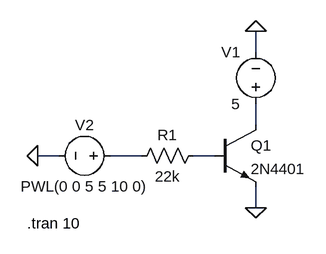
[diagram p0: schematic Übertragungskennlinie.asc]
Übertragungskennlinie.asc, the LTspice schematic file:
Version 4.1
SHEET 1 880 680
WIRE 192 0 192 -32
WIRE 192 112 192 80
WIRE -112 160 -144 160
WIRE 16 160 -32 160
WIRE 128 160 96 160
WIRE 192 240 192 208
FLAG 192 -32 0
FLAG 192 240 0
FLAG -144 160 0
SYMBOL npn 128 112 R0
SYMATTR InstName Q1
SYMATTR Value 2N4401
SYMBOL voltage 192 96 R180
WINDOW 0 24 96 Left 2
WINDOW 3 24 16 Left 2
WINDOW 123 0 0 Left 0
WINDOW 39 0 0 Left 0
SYMATTR InstName V1
SYMATTR Value 5
SYMBOL res 112 144 R90
WINDOW 0 0 56 VBottom 2
WINDOW 3 32 56 VTop 2
SYMATTR InstName R1
SYMATTR Value 22k
SYMBOL voltage -16 160 R90
WINDOW 0 -32 56 VBottom 2
WINDOW 3 32 56 VTop 2
WINDOW 123 0 0 Left 0
WINDOW 39 0 0 Left 0
SYMATTR InstName V2
SYMATTR Value PWL(0 0 5 5 10 0)
TEXT -160 264 Left 2 !.tran 10

The netlist it stands for:
* Übertragungskennlinie.asc
Q1 N001 N003 0 0 2N4401
V1 N001 0 5
R1 N003 N002 22k
V2 N002 0 PWL(0 0 5 5 10 0)
.model NPN NPN
.model PNP PNP
.lib standard.bjt
.tran 10
.backanno
.end

* Results of the author's LTspice run, read from the files saved beside the schematic
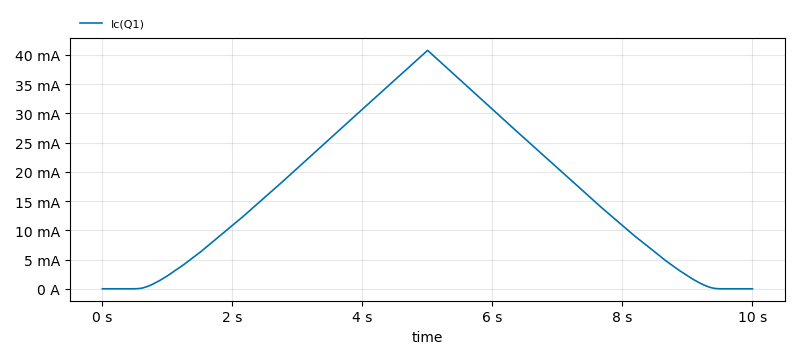
[diagram p1: Transient Analysis of Übertragungskennlinie.asc, plotted from the saved traces]
* Transient Analysis, 1 run:
*   Ic(Q1): min 0 A, max 40.75 mA, average 16.76 mA, rms 21.55 mA, last 0 A